# EAGLE design Croduino SAMD v1.0 (EAGLE 7.3.0)

## Sheet 1 of 3
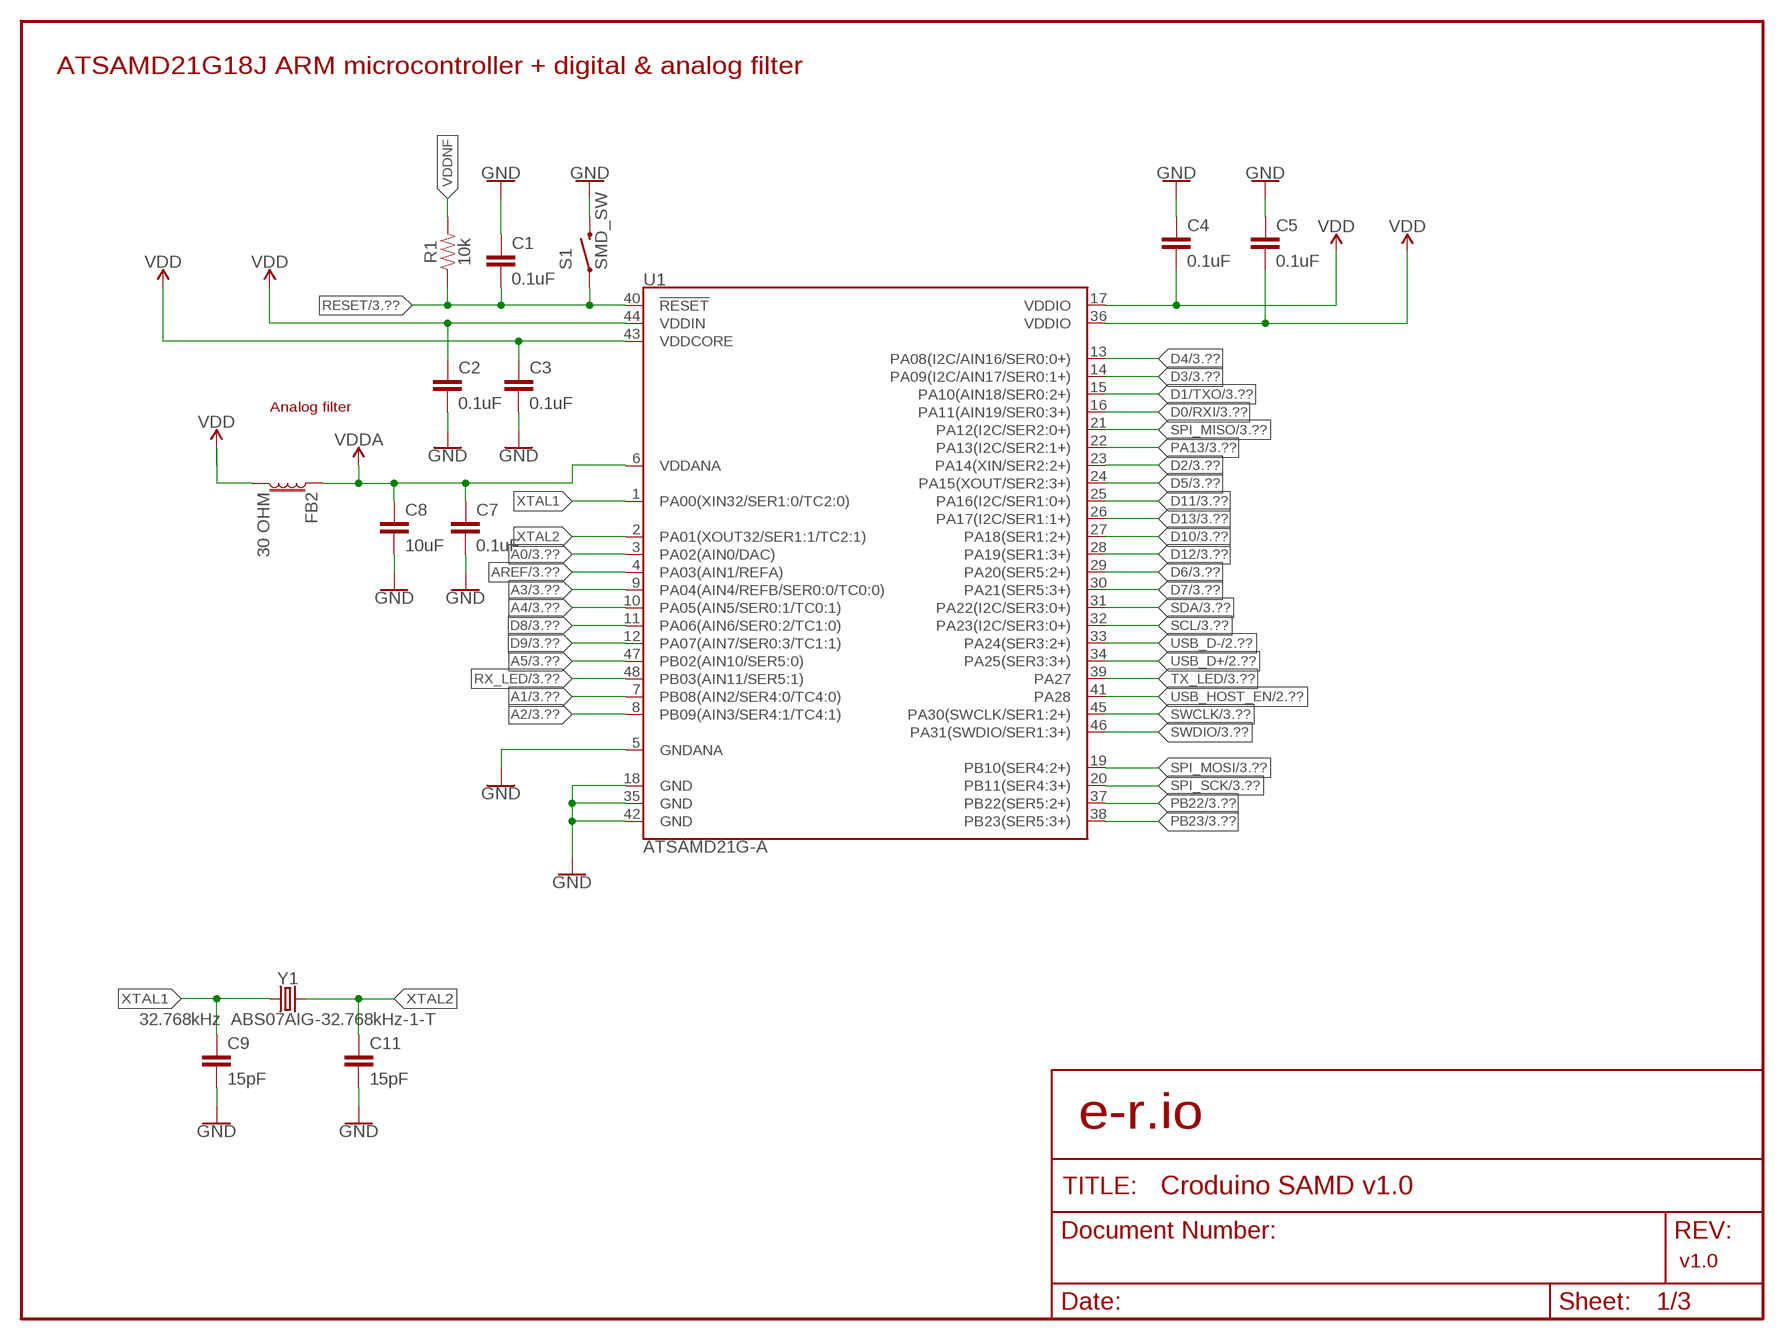
[diagram p0: schematic, sheet 1]

### Parts
C1  0.1uF  0.1UF-0603-25V-(+80/-20%)  [0603]
C2  0.1uF  0.1UF-0603-25V-(+80/-20%)  [0603]
C3  0.1uF  0.1UF-0603-25V-(+80/-20%)  [0603]
C4  0.1uF  0.1UF-0603-25V-(+80/-20%)  [0603]
C5  0.1uF  0.1UF-0603-25V-(+80/-20%)  [0603]
C7  0.1uF  0.1UF-0603-25V-(+80/-20%)  [0603]
C8  10uF  10UF-1206-6.3V-20%  [1206]
C9  15pF  15PF-0603-50V-5%  [0603]
C11  15pF  15PF-0603-50V-5%  [0603]
FB2  30 OHM  FERRITE_BEAD-0603  [0603]
R1  10k  10KOHM-0603-1/10W-1%  [0603]
S1  SMD_SW  SWITCH-MOMENTARY-2SMD  [TACTILE_SWITCH_SMD]
U1  ATSAMD21G-A  [TQFP-48]
Y1  32.768kHz ABS07AIG-32.768kHz-1-T  CRYSTAL-32.768KHZSMD-3.2X1.5  [CRYSTAL-SMD-3.2X1.5MM]

### Nets
A0: U1.3(PA02(AIN0/DAC)) ; also sheet 3
A1: U1.7(PB08(AIN2/SER4:0/TC4:0)) ; also sheet 3
A2: U1.8(PB09(AIN3/SER4:1/TC4:1)) ; also sheet 3
A3: U1.9(PA04(AIN4/REFB/SER0:0/TC0:0)) ; also sheet 3
A4: U1.10(PA05(AIN5/SER0:1/TC0:1)) ; also sheet 3
A5: U1.47(PB02(AIN10/SER5:0)) ; also sheet 3
AREF: U1.4(PA03(AIN1/REFA)) ; also sheet 3
D0/RXI: U1.16(PA11(AIN19/SER0:3+)) ; also sheet 3
D1/TXO: U1.15(PA10(AIN18/SER0:2+)) ; also sheet 3
D2: U1.23(PA14(XIN/SER2:2+)) ; also sheet 3
D3: U1.14(PA09(I2C/AIN17/SER0:1+)) ; also sheet 3
D4: U1.13(PA08(I2C/AIN16/SER0:0+)) ; also sheet 3
D5: U1.24(PA15(XOUT/SER2:3+)) ; also sheet 3
D6: U1.29(PA20(SER5:2+)) ; also sheet 3
D7: U1.30(PA21(SER5:3+)) ; also sheet 3
D8: U1.11(PA06(AIN6/SER0:2/TC1:0)) ; also sheet 3
D9: U1.12(PA07(AIN7/SER0:3/TC1:1)) ; also sheet 3
D10: U1.27(PA18(SER1:2+)) ; also sheet 3
D11: U1.25(PA16(I2C/SER1:0+)) ; also sheet 3
D12: U1.28(PA19(SER1:3+)) ; also sheet 3
D13: U1.26(PA17(I2C/SER1:1+)) ; also sheet 3
GND: C1.1 C2.2 C3.2 C4.1 C5.1 C7.2 C8.2 C9.2 C11.2 S1.3 U1.5(GNDANA) U1.18(GND) U1.35(GND) U1.42(GND) ; also sheet 2,3
PA13: U1.22(PA13(I2C/SER2:1+)) ; also sheet 3
PB22: U1.37(PB22(SER5:2+)) ; also sheet 3
PB23: U1.38(PB23(SER5:3+)) ; also sheet 3
RESET: C1.2 R1.1 S1.1 U1.40(!RESET!) ; also sheet 3
RX_LED: U1.48(PB03(AIN11/SER5:1)) ; also sheet 3
SCL: U1.32(PA23(I2C/SER3:0+)) ; also sheet 3
SDA: U1.31(PA22(I2C/SER3:0+)) ; also sheet 3
SPI_MISO: U1.21(PA12(I2C/SER2:0+)) ; also sheet 3
SPI_MOSI: U1.19(PB10(SER4:2+)) ; also sheet 3
SPI_SCK: U1.20(PB11(SER4:3+)) ; also sheet 3
SWCLK: U1.45(PA30(SWCLK/SER1:2+)) ; also sheet 3
SWDIO: U1.46(PA31(SWDIO/SER1:3+)) ; also sheet 3
TX_LED: U1.39(PA27) ; also sheet 3
USB_D+: U1.34(PA25(SER3:3+)) ; also sheet 2
USB_D-: U1.33(PA24(SER3:2+)) ; also sheet 2
USB_HOST_EN: U1.41(PA28) ; also sheet 2
VDD: C2.1 C3.1 C4.2 C5.2 FB2.2 U1.17(VDDIO) U1.36(VDDIO) U1.43(VDDCORE) U1.44(VDDIN) ; also sheet 2,3
VDDA: C7.1 C8.1 FB2.1 U1.6(VDDANA)
VDDNF: R1.2
XTAL1: C9.1 U1.1(PA00(XIN32/SER1:0/TC2:0)) Y1.P$1
XTAL2: C11.1 U1.2(PA01(XOUT32/SER1:1/TC2:1)) Y1.P$2

### Notes on the sheet
- ATSAMD21G18J ARM microcontroller + digital & analog filter
- Analog filter
- e-r.io
- v1.0

## Sheet 2 of 3
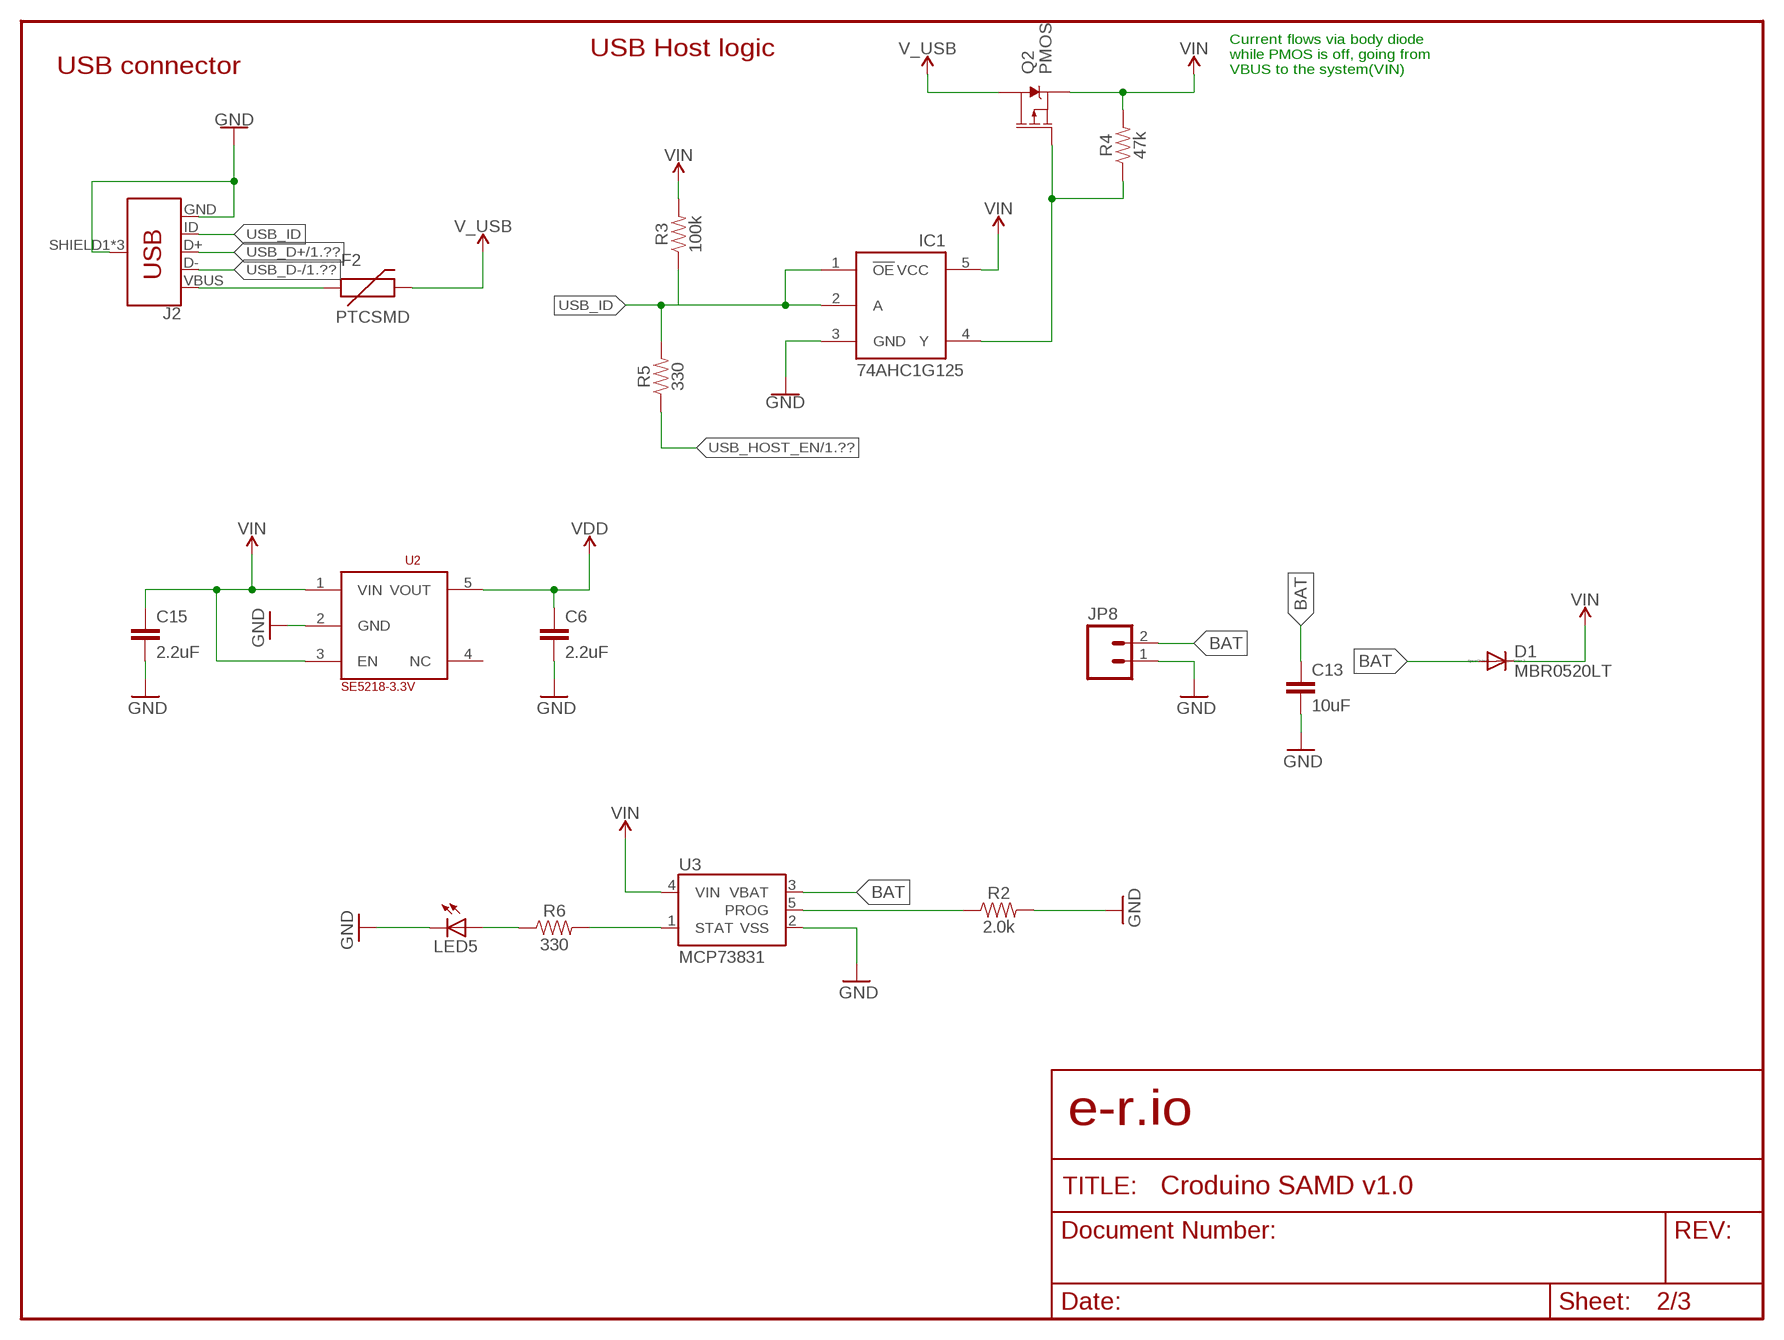
[diagram p1: schematic, sheet 2]

### Parts
C6  2.2uF  2.2UF-0603-10V-20%  [0603]
C13  10uF  10UF-1206-6.3V-20%  [1206]
C15  2.2uF  2.2UF-0603-10V-20%  [0603]
D1  MBR0520LT  [SOD123]
F2  PTCSMD  [PTC-1206]
IC1  74AHC1G125  [SOT23-5L]
J2  USB_MICRO-BREDUCED_PASTE  [USB-B-MICRO-SMD_RED_PASTE]
JP8  M02-JST-2MM-SMT  [JST-2-SMD]
LED5  LEDCHIPLED_0805  [CHIPLED_0805]
Q2  PMOS  MOSFET_PCH-DMG2307L  [SOT23-3]
R2  2.0k  2.0KOHM-0603-1/10W-5%  [0603]
R3  100k  100KOHM-0603-1/10W-1%  [0603]
R4  47k  47KOHM-0603-1/10W-1%  [0603]
R5  330  330OHM-0603-1/10W-1%  [0603]
R6  330  330OHM-0603-1/10W-1%  [0603]
U2  SE5218-3.3V  SE5218  [SOT23-5]
U3  MCP73831  [SOT23-5]

### Nets
BAT: C13.1 D1.A JP8.2 U3.3(VBAT)
GND: C6.2 C13.2 C15.2 IC1.3(GND) J2.GND J2.SHIELD1(SHIELD) J2.SHIELD2(SHIELD) J2.SHIELD3(SHIELD) JP8.1 LED5.C R2.2 U2.2(GND) U3.2(VSS) ; also sheet 1,3
N$2: R6.2 U3.1(STAT)
N$9: F2.1 J2.VBUS
N$10: IC1.4(Y) Q2.1(G) R4.1
N$11: LED5.A R6.1
N$12: R2.1 U3.5(PROG)
USB_D+: J2.D+ ; also sheet 1
USB_D-: J2.D- ; also sheet 1
USB_HOST_EN: R5.1 ; also sheet 1
USB_ID: IC1.1(!OE) IC1.2(A) J2.ID R3.1 R5.2
V_USB: F2.2 Q2.3(D) ; also sheet 3
VDD: C6.1 U2.5(VOUT) ; also sheet 1,3
VIN: C15.1 D1.C IC1.5(VCC) Q2.2(S) R3.2 R4.2 U2.1(VIN) U2.3(EN) U3.4(VIN) ; also sheet 3
Unconnected: U2.4(NC)

### Notes on the sheet
- USB Host logic
- USB connector
- Current flows via body diode
  while PMOS is off, going from
  VBUS to the system(VIN)
- e-r.io

## Sheet 3 of 3
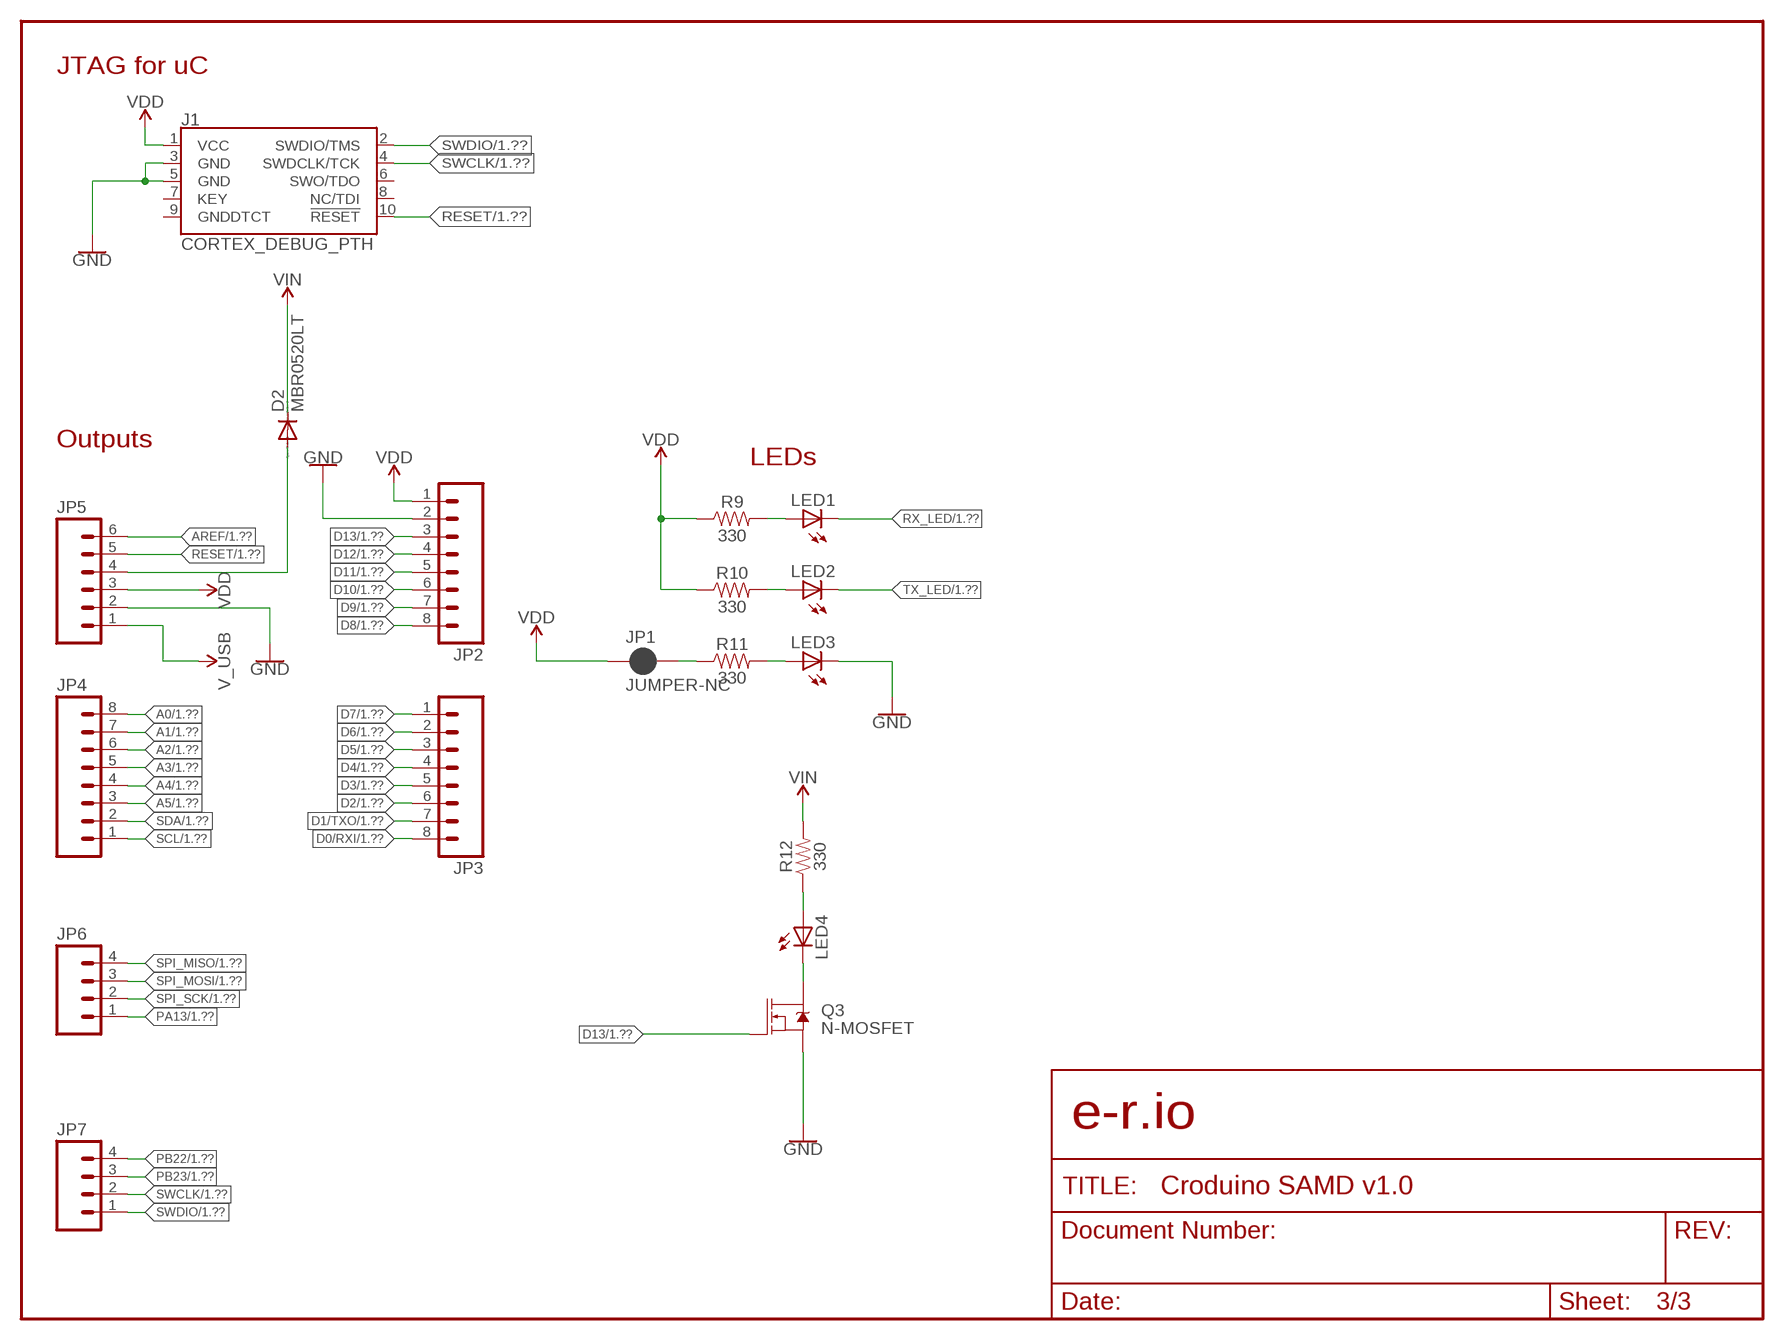
[diagram p2: schematic, sheet 3]

### Parts
D2  MBR0520LT  [SOD123]
J1  CORTEX_DEBUG_PTH  [2X5-PTH-1.27MM]
JP1  JUMPER-NC  JUMPER-SMT_2_NC_PASTE_NO-SILK  [SMT-JUMPER_2_NC_PASTE_NO-SILK]
JP2  M081X08  [1X08]
JP3  M081X08  [1X08]
JP4  M081X08  [1X08]
JP5  M06SIP  [1X06]
JP6  M04PTH  [1X04]
JP7  M04PTH  [1X04]
LED1  LEDCHIPLED_0805  [CHIPLED_0805]
LED2  LEDCHIPLED_0805  [CHIPLED_0805]
LED3  LEDCHIPLED_0805  [CHIPLED_0805]
LED4  LEDCHIPLED_0805  [CHIPLED_0805]
Q3  N-MOSFET  MOSFET-NCH-AO3404A  [SOT23-3]
R9  330  330OHM-0603-1/10W-1%  [0603]
R10  330  330OHM-0603-1/10W-1%  [0603]
R11  330  330OHM-0603-1/10W-1%  [0603]
R12  330  330OHM-0603-1/10W-1%  [0603]

### Nets
A0: JP4.8 ; also sheet 1
A1: JP4.7 ; also sheet 1
A2: JP4.6 ; also sheet 1
A3: JP4.5 ; also sheet 1
A4: JP4.4 ; also sheet 1
A5: JP4.3 ; also sheet 1
AREF: JP5.6 ; also sheet 1
D0/RXI: JP3.8 ; also sheet 1
D1/TXO: JP3.7 ; also sheet 1
D2: JP3.6 ; also sheet 1
D3: JP3.5 ; also sheet 1
D4: JP3.4 ; also sheet 1
D5: JP3.3 ; also sheet 1
D6: JP3.2 ; also sheet 1
D7: JP3.1 ; also sheet 1
D8: JP2.8 ; also sheet 1
D9: JP2.7 ; also sheet 1
D10: JP2.6 ; also sheet 1
D11: JP2.5 ; also sheet 1
D12: JP2.4 ; also sheet 1
D13: JP2.3 Q3.1(G) ; also sheet 1
GND: J1.3(GND) J1.5(GND) JP2.2 JP5.2 LED3.C Q3.2(S) ; also sheet 1,2
N$1: JP1.2 R11.1
N$3: LED4.A R12.1
N$4: D2.A JP5.4
N$5: LED3.A R11.2
N$6: LED2.A R10.2
N$7: LED1.A R9.2
N$8: LED4.C Q3.3(D)
PA13: JP6.1 ; also sheet 1
PB22: JP7.4 ; also sheet 1
PB23: JP7.3 ; also sheet 1
RESET: J1.10(!RESET) JP5.5 ; also sheet 1
RX_LED: LED1.C ; also sheet 1
SCL: JP4.1 ; also sheet 1
SDA: JP4.2 ; also sheet 1
SPI_MISO: JP6.4 ; also sheet 1
SPI_MOSI: JP6.3 ; also sheet 1
SPI_SCK: JP6.2 ; also sheet 1
SWCLK: J1.4(SWDCLK/TCK) JP7.2 ; also sheet 1
SWDIO: J1.2(SWDIO/TMS) JP7.1 ; also sheet 1
TX_LED: LED2.C ; also sheet 1
V_USB: JP5.1 ; also sheet 2
VDD: J1.1(VCC) JP1.1 JP2.1 JP5.3 R9.1 R10.1 ; also sheet 1,2
VIN: D2.C R12.2 ; also sheet 2
Unconnected: J1.6(SWO/TDO) J1.7(KEY) J1.8(NC/TDI) J1.9(GNDDTCT)

### Notes on the sheet
- JTAG for uC
- Outputs
- LEDs
- e-r.io

## Library data of the parts
C1-C5 C7 = SparkFun-Capacitors:0.1UF: 0.1µF ceramic capacitors A capacitor is a passive two-terminal electrical component used to store electrical energy temporarily in an electric field.; PROD_ID: CAP-00810
C6 C15 = SparkFun-Capacitors:2.2UF: 2.2µF ceramic capacitors A capacitor is a passive two-terminal electrical component used to store electrical energy temporarily in an electric field.; PROD_ID: CAP-07888
C8 C13 = SparkFun-Capacitors:10UF: 10.0µF ceramic capacitors A capacitor is a passive two-terminal electrical component used to store electrical energy temporarily in an electric field.; PROD_ID: CAP-10057
C9 C11 = SparkFun-Capacitors:15PF: 15pF ceramic capacitors A capacitor is a passive two-terminal electrical component used to store electrical energy temporarily in an electric field.; PROD_ID: CAP-07881
D1 D2 = diode:MBR0520LT: SCHOTTKY BARRIER RECTIFIER Source: http://onsemi.com .. MBR0520LT1-D.pdf
F2 = SparkFun:PTC: Resettable Fuse PTC Resettable Fuse. Spark Fun Electronics SKU : COM-08357
FB2 = SparkFun-Coils:FERRITE_BEAD: Ferrite Bead (blocks, cores, rings, chokes, etc.) Inductor with layers of ferrite used to suppress high frequencies. Often used to isolate high frequency noise. SparkFun Products: IOIO-OTG - V2.2 SparkFun SAMD21 Mini Breakout SparkFun 6 Degrees of Freedom Breakout - LSM6DS3 SparkFun SAMD21 Dev Breakout; PROD_ID: NDUC-07859; VALUE: 30Ω/1.8A
IC1 = adafruit:74AHC1G125
J1 = SparkFun-Connectors:CORTEX_DEBUG: Cortex Debug Connector - 10 pin Supports JTAG debug, Serial Wire debug, and Serial Wire Viewer. PTH and SMD connector options available. General Connector Information <http://infocenter.arm.com/help/topic/com.arm.doc.faqs/attached/13634/cortex_debug_connectors.pdf> Products: PTH Connector <http://www.digikey.com/product-detail/en/cnc-tech/3220-10-0100-00/1175-1627-ND/3883661> -via Digi-Key SparkFun PSoc <https://www.sparkfun.com/products/13229> SparkFun T <https://www.sparkfun.com/products/13810>
J2 = SparkFun-Connectors:USB_MICRO-B: USB Type Micro-B Connector Male/female and PTH/SMT variants SparkFun Products: SparkFun microB USB Breakout <https://www.sparkfun.com/products/12035> SparkFun USB microB Plug Breakout <https://www.sparkfun.com/products/10031> SparkFun ESP8266 Thing <https://www.sparkfun.com/products/13231>; PROD_ID: CONN-11752
JP1 = SparkFun-Jumpers:JUMPER-SMT_2_NC_PASTE: Normally closed solder jumper This jumper has an aperture in the stencil to allow solder paste to bridge the split in the wire so it's normally closed (NC). Wick off the solder to open the connection. Reapply solder to reclose the connection.
JP2-JP4 = SparkFun:M08: Header 8 Standard 8-pin 0.1" header. Use with straight break away headers (SKU : PRT-00116), right angle break away headers (PRT-00553), swiss pins (PRT-00743), machine pins (PRT-00117), and female headers (PRT-00115).
JP5 = SparkFun:M06: Header 6 Standard 6-pin 0.1" header. Use with straight break away headers (SKU : PRT-00116), right angle break away headers (PRT-00553), swiss pins (PRT-00743), machine pins (PRT-00117), and female headers (PRT-00115). Molex polarized connector foot print use with SKU : PRT-08094 with associated crimp pins and housings. NOTES ON THE VARIANTS LOCK and LOCK_LONGPADS... This footprint was designed to help hold the alignment of a through-hole component (i.e. 6-pin header) while soldering it into place. You may notice that each hole has been shifted either up or down by 0.005 of an inch from it's more standard position (which is a perfectly straight line). This slight alteration caused the pins (the squares in the middle) to touch the edges of the holes. Because they are alternating, it causes a "brace" to hold the component in place. 0.005 has proven to be the perfect amount of "off-center" position when using our standard breakaway headers. Although looks a little odd when you look at the bare footprint, once you have a header in there, the alteration is very hard to notice. Also, if you push a header all the way into place, it is covered up entirely on the bottom side. This idea of altering the position of holes to aid alignment will be further integrated into the Sparkfun Library for other footprints. It can help hold any component with 3 or more connection pins.
JP6 JP7 = SparkFun:M04: Header 4 Standard 4-pin 0.1" header. Use with straight break away headers (SKU : PRT-00116), right angle break away headers (PRT-00553), swiss pins (PRT-00743), machine pins (PRT-00117), and female headers (PRT-00115). Molex polarized connector foot print use with SKU : PRT-08231 with associated crimp pins and housings. 1MM SMD Version SKU: PRT-10208
JP8 = SparkFun:M02: Header 2 Standard 2-pin 0.1" header. Use with straight break away headers (SKU : PRT-00116), right angle break away headers (PRT-00553), swiss pins (PRT-00743), machine pins (PRT-00117), and female headers (PRT-00115). Molex polarized connector foot print use with SKU : PRT-08233 with associated crimp pins and housings.
LED1-LED5 = adafruit:LED: LED OSRAM: - CHIPLED LG R971, LG N971, LY N971, LG Q971, LY Q971, LO R971, LY R971 LH N974, LH R974 LS Q976, LO Q976, LY Q976 LO Q996 - Hyper CHIPLED LW Q18S LB Q993, LB Q99A, LB R99A - SideLED LS A670, LO A670, LY A670, LG A670, LP A670 LB A673, LV A673, LT A673, LW A673 LH A674 LY A675 LS A676, LA A676, LO A676, LY A676, LW A676 LS A679, LY A679, LG A679 - Hyper Micro SIDELED® LS Y876, LA Y876, LO Y876, LY Y876 LT Y87S - SmartLED LW L88C, LW L88S LB L89C, LB L89S, LG L890 LS L89K, LO L89K, LY L89K LS L896, LA L896, LO L896, LY L896 - TOPLED LS T670, LO T670, LY T670, LG T670, LP T670 LSG T670, LSP T670, LSY T670, LOP T670, LYG T670 LG T671, LOG T671, LSG T671 LB T673, LV T673, LT T673, LW T673 LH T674 LS T676, LA T676, LO T676, LY T676, LB T676, LH T676, LSB T676, LW T676 LB T67C, LV T67C, LT T67C, LS T67K, LO T67K, LY T67K, LW E67C LS E67B, LA E67B, LO E67B, LY E67B, LB E67C, LV E67C, LT E67C LW T67C LS T679, LY T679, LG T679 LS T770, LO T770, LY T770, LG T770, LP T770 LB T773, LV T773, LT T773, LW T773 LH T774 LS E675, LA E675, LY E675, LS T675 LS T776, LA T776, LO T776, LY T776, LB T776 LHGB T686 LT T68C, LB T68C - Hyper Mini TOPLED® LB M676 - Mini TOPLED Santana® LG M470 LS M47K, LO M47K, LY M47K Source: http://www.osram.convergy.de/
Q2 = SparkFun-DiscreteSemi:MOSFET_PCH: P-channel MOSFETs Voltage controlled devices that allow control of high current outputs. SparkFun Products: SparkFun ESP32 Thing <https://www.sparkfun.com/products/13907> SparkFun ESP8266 Thing <https://www.sparkfun.com/products/13231>; PROD_ID: TRANS-11308; VALUE: 2.5A/30V/105mΩ
Q3 = SparkFun-DiscreteSemi:MOSFET-NCH: N-channel MOSFETs Voltage controlled devices that allow control of high current outputs. SparkFun Products: SparkFun OpenScale <https://www.sparkfun.com/products/13261> SparkFun Digital Sandbox <https://www.sparkfun.com/products/12651> SparkFun Monster Moto Shield <https://www.sparkfun.com/products/10182> SparkFun MOSFET Power Controller <https://www.sparkfun.com/products/11214>; PROD_ID: TRANS-12988; VALUE: 5.8A/30V/35mΩ
R1 = SparkFun-Resistors:10KOHM: 10kΩ resistor A resistor is a passive two-terminal electrical component that implements electrical resistance as a circuit element. Resistors act to reduce current flow, and, at the same time, act to lower voltage levels within circuits. - Wikipedia; PROD_ID: RES-00824
R2 = SparkFun-Resistors:2.0KOHM: 2kΩ resistor A resistor is a passive two-terminal electrical component that implements electrical resistance as a circuit element. Resistors act to reduce current flow, and, at the same time, act to lower voltage levels within circuits. - Wikipedia; PROD_ID: RES-08296
R3 = SparkFun-Resistors:100KOHM: 100kΩ resistor A resistor is a passive two-terminal electrical component that implements electrical resistance as a circuit element. Resistors act to reduce current flow, and, at the same time, act to lower voltage levels within circuits. - Wikipedia; PROD_ID: RES-07828
R4 = SparkFun-Resistors:47KOHM: 47kΩ resistor A resistor is a passive two-terminal electrical component that implements electrical resistance as a circuit element. Resistors act to reduce current flow, and, at the same time, act to lower voltage levels within circuits. - Wikipedia; PROD_ID: RES-07871
R5 R6 R9-R12 = SparkFun-Resistors:330OHM: 330Ω resistor A resistor is a passive two-terminal electrical component that implements electrical resistance as a circuit element. Resistors act to reduce current flow, and, at the same time, act to lower voltage levels within circuits. - Wikipedia; PROD_ID: RES-00818
S1 = SparkFun:SWITCH-MOMENTARY-2
U1 = SparkFun-IC-Microcontroller:ATSAMD21G: Atmel SAMD21G SMART ARM-Based Microcontroller The Atmel ® | SMART ™ SAM D21 is a series of low-power microcontrollers using the 32-bit ARM ® Cortex ® -M0+ processor, and ranging from 32- to 64-pins with up to 256KB Flash and 32KB of SRAM. The SAM D21 devices operate at a maximum frequency of 48MHz and reach 2.46 CoreMark/MHz. They are designed for simple and intuitive migration with identical peripheral modules, hex compatible code, identical linear address map and pin compatible migration paths between all devices in the product series. All devices include intelligent and flexible peripherals, Atmel Event System for inter-peripheral signaling, and support for capacitive touch button, slider and wheel user interfaces. Datasheet SparkFun Products SparkFun SAMD21 Mini Breakout (DEV-13664) SparkFun SAMD21 Dev Breakout (DEV-13672); PROD_ID: IC-13064
U2 = ERADIONICA:SE5218
U3 = SparkFun-IC-Power:MCP73831: MCP73831T Li-Ion, Li-Pol Controller Miniature single cell, fully integrated Li-Ion, Li-polymer charge management controller Datasheet <http://ww1.microchip.com/downloads/en/DeviceDoc/20001984g.pdf> SparkFun Products: SparkFun ESP32 Thing <https://www.sparkfun.com/products/13907> SparkFun 9DoF Razor IMU M0 <https://www.sparkfun.com/products/14001>; PROD_ID: IC-09995
Y1 = SparkFun-Clocks:CRYSTAL-32.768KHZ: 32.768kHz Crystal Frequency: 32.768kHz Frequency Stability: ±20ppm Load Capacitance: 12.5pF (PTH-2X6 & SMD-3.2X1.5), 6pF (SMD-2X6) SparkFun Products: SparkFun BigTime Watch Kit <https://www.sparkfun.com/products/11734> SparkFun nRF52832 Breakout <https://www.sparkfun.com/products/13990> SparkFun Real Time Clock Module <https://www.sparkfun.com/products/12708>; PROD_ID: XTAL-13062; VALUE: 32.768kHz

## Board
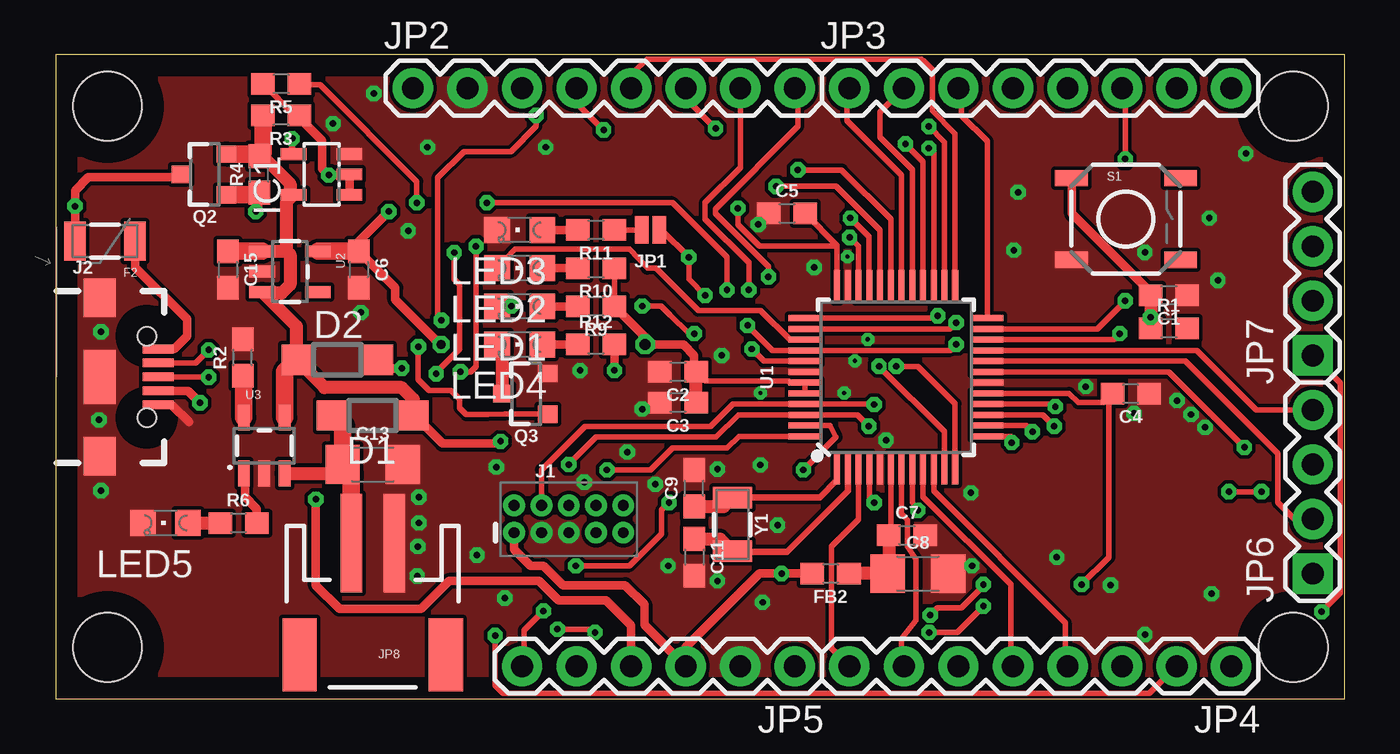
[diagram p3: board, top side]
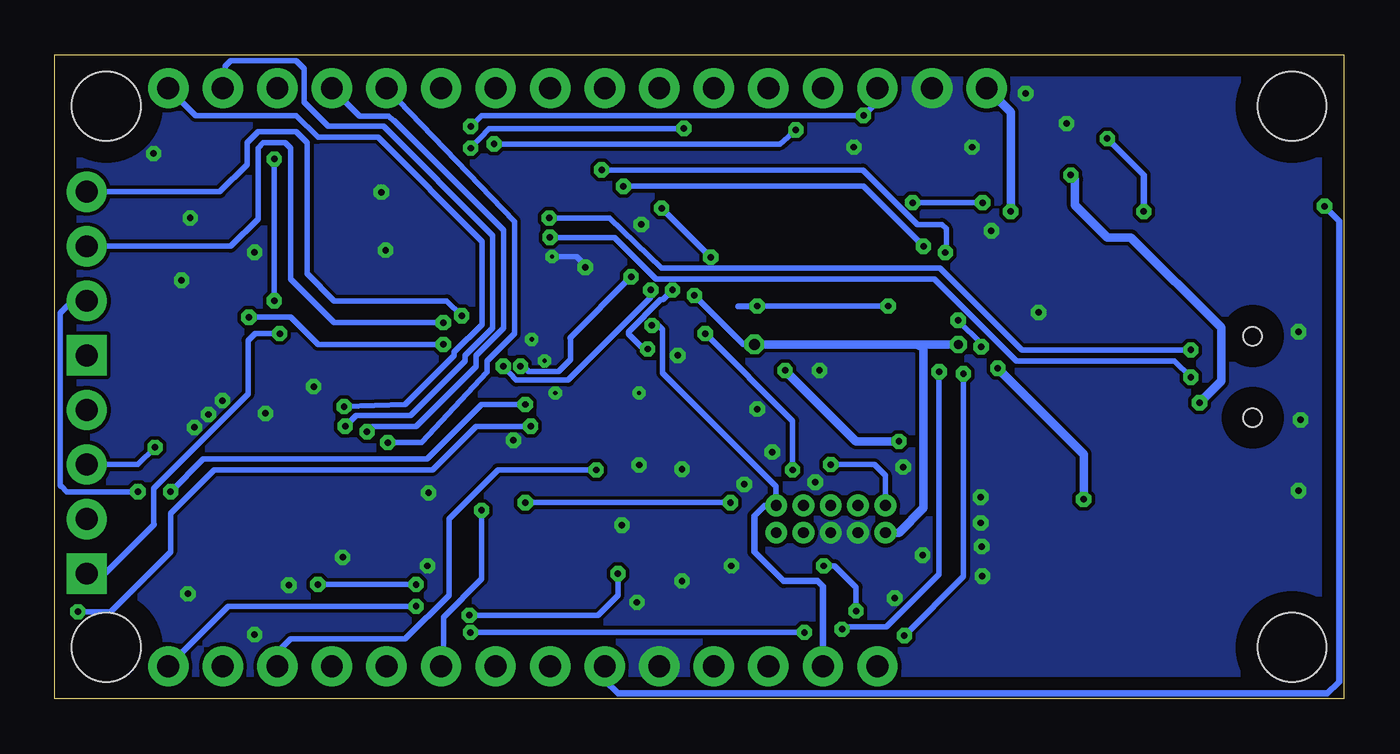
[diagram p4: board, bottom side, seen from below]

Size 60 x 30 mm. Coordinates in mm from the lower left corner, seen from the top.
Outline: 0,0 60,0 60,30 0,30 0,0
Copper layers (1*16): Top 0.035mm / dielectric 1.5mm / Bottom 0.035mm
Design rules "default *": minimum track width 10mil, minimum drill 24mil, track to track 0.17mm, track to pad 0.17mm, pad to pad 0.17mm, via to via 0.17mm, smd to smd 0.17mm, copper to edge 40mil, drill to drill 8mil, minimum pad ring 10mil, minimum via ring 8mil, stop-mask expansion 4mil, vias tented up to drill 0.6mm, thermal gap 10mil
Holes 3.2 mm at 2.4,2.4 2.4,27.6 57.6,2.4 57.6,27.6

### Footprints (pad centres in the part's own frame; a part is rotated, then mirrored left to right if it is on the bottom)
0603 = smd 1.1 x 1: 1 -0.85,0; 2 0.85,0
1206 = smd 1.6 x 1.8: 1 -1.4,0; 2 1.4,0
SOD123 = smd 1.4 x 1.4: A 1.9,0; C -1.9,0
PTC-1206 = smd 1 x 1.8: 1 -1.4,0; 2 1.4,0
SOT23-5L = smd 0.55 x 1.2: 1 -0.95,-1.3; 2 0,-1.3; 3 0.95,-1.3; 4 0.95,1.3; 5 -0.95,1.3
2X5-PTH-1.27MM = drill 0.508 pad 1: 1 -2.54,-0.635; 2 -2.54,0.635; 3 -1.27,-0.635; 4 -1.27,0.635; 5 0,-0.635; 6 0,0.635; 7 1.27,-0.635; 8 1.27,0.635; 9 2.54,-0.635; 10 2.54,0.635
USB-B-MICRO-SMD_RED_PASTE = smd 1.45 x 0.4: D+ 2.725,0; D- 2.725,0.65; GND 2.725,-1.3; ID 2.725,-0.65; VBUS 2.725,1.3 | smd 1.5 x 1.8: SHIELD1 0,3.685; SHIELD2 0,-3.685 | smd 1.5 x 2.5: SHIELD3 0,0 | hole 0.85: 2.2,1.9; 2.2,-1.9
SMT-JUMPER_2_NC_PASTE_NO-SILK = smd 0.635 x 1.27: 1 -0.406,0; 2 0.406,0
1X08 = drill 1.016 pad 1.88: 1 0,0; 2 2.54,0; 3 5.08,0; 4 7.62,0; 5 10.16,0; 6 12.7,0; 7 15.24,0; 8 17.78,0
1X06 = drill 1.016 pad 1.88: 1 0,0; 2 2.54,0; 3 5.08,0; 4 7.62,0; 5 10.16,0; 6 12.7,0
1X04 = drill 1.016 pad 1.88 square: 1 0,0 | drill 1.016 pad 1.88: 2 2.54,0; 3 5.08,0; 4 7.62,0
JST-2-SMD = smd 1 x 4.6: 1 -1,-3.7; 2 1,-3.7 | smd 1.6 x 3.4: NC1 -3.4,1.5; NC2 3.4,1.5
CHIPLED_0805 = smd 1.2 x 1.2: A 0,-1.05; C 0,1.05
SOT23-3 = smd 0.8 x 0.9: 1 -0.95,-1; 2 0.95,-1; 3 0,1.1
TACTILE_SWITCH_SMD = smd 1.524 x 0.762: 1 -2.54,1.905; 2 2.54,1.905; 3 -2.54,-1.905; 4 2.54,-1.905
TQFP-48 = smd 1.5 x 0.28: 1 -4.25,2.75; 2 -4.25,2.25; 3 -4.25,1.75; 4 -4.25,1.25; 5 -4.25,0.75; 6 -4.25,0.25; 7 -4.25,-0.25; 8 -4.25,-0.75; 9 -4.25,-1.25; 10 -4.25,-1.75; 11 -4.25,-2.25; 12 -4.25,-2.75; 25 4.25,-2.75; 26 4.25,-2.25; 27 4.25,-1.75; 28 4.25,-1.25; 29 4.25,-0.75; 30 4.25,-0.25; 31 4.25,0.25; 32 4.25,0.75; 33 4.25,1.25; 34 4.25,1.75; 35 4.25,2.25; 36 4.25,2.75 | smd 0.28 x 1.5: 13 -2.75,-4.25; 14 -2.25,-4.25; 15 -1.75,-4.25; 16 -1.25,-4.25; 17 -0.75,-4.25; 18 -0.25,-4.25; 19 0.25,-4.25; 20 0.75,-4.25; 21 1.25,-4.25; 22 1.75,-4.25; 23 2.25,-4.25; 24 2.75,-4.25; 37 2.75,4.25; 38 2.25,4.25; 39 1.75,4.25; 40 1.25,4.25; 41 0.75,4.25; 42 0.25,4.25; 43 -0.25,4.25; 44 -0.75,4.25; 45 -1.25,4.25; 46 -1.75,4.25; 47 -2.25,4.25; 48 -2.75,4.25
SOT23-5 = smd 0.55 x 1.2: 1 -0.95,-1.3; 2 0,-1.3; 3 0.95,-1.3; 4 0.95,1.3; 5 -0.95,1.3
CRYSTAL-SMD-3.2X1.5MM = smd 1 x 1.8: P$1 -1.25,0; P$2 1.25,0

### Placement (x,y rotation side)
C1  51.82,18.8 180 top
C2  28.96,15.24 180 top
C3  28.96,13.8 180 top
C4  50.04,14.22 180 top
C5  34.04,22.61 0 top
C6  14.1,20 270 top
C7  39.62,7.62 0 top
C8  40.13,5.84 0 top
C9  29.72,9.82 90 top
C11  29.72,6.6 270 top
C13  14.75,10.92 0 top
C15  8,20 270 top
D1  14.75,13.21 180 top
D2  13.1,15.8 0 top
F2  2.29,21.33 180 top
FB2  36.07,5.84 180 top
IC1  12.37,24.43 90 top
J1  23.88,8.38 0 top
J2  2.03,15 0 top
JP1  27.68,21.84 180 top
JP2  16.62,28.45 0 top
JP3  36.94,28.45 0 top
JP4  54.72,1.52 180 top
JP5  34.4,1.52 180 top
JP6  58.51,5.84 90 top
JP7  58.51,16 90 top
JP8  14.75,3.56 180 top
LED1  21.59,18.29 90 top
LED2  21.59,20.07 90 top
LED3  21.59,21.84 90 top
LED4  21.59,16.51 90 top
LED5  5.1,8.2 90 top
Q2  6.93,24.43 90 top
Q3  21.9,14.22 90 top
R1  51.82,17.27 0 top
R2  8.7,15.9 90 top
R3  10.49,27.17 180 top
R4  9.47,24.43 90 top
R5  10.49,28.65 180 top
R6  8.5,8.2 0 top
R9  25.15,18.29 180 top
R10  25.15,20.07 180 top
R11  25.15,21.84 180 top
R12  25.15,16.51 0 top
S1  49.82,22.35 0 top
U1  39.12,14.99 90 top
U2  10.9,19.9 270 top
U3  9.7,11.8 0 top
U$1  [SAMD-GRAFIKA]  44.2,5 0 top
U$2  [LOGO-4MM]  5.2,3 0 top
U$3  [OSH-3MM]  49.3,9.6 0 top
U$4  [E-R.IO-3MM]  3.9,13.6 90 top
U$8  [MADE-IN-CROATIA-5MM]  12.2,1.4 0 top
U$9  [LUDI-LOGO-24MM]  30.6,2.9 90 bottom
U$10  [SAMD-BACK]  13,0 0 top
U$11  [OSH-BACK-6MM]  7.2,21.5 270 top
U$12  [E-R.IO-6MM]  4.3,0.8 0 top
U$13  [LOGO-BACK-6MM]  7.2,14.1 270 top
U$14  [E-R.IO-BACK-12MM]  0,21.1 270 top
Y1  31.5,8.13 270 top

### Tracks (layer width: path | path; a pad name or v marks a point on that pad's centre or on a via)
A0
  Top 0.254: U1.3 37.37,8.37 36.1,7.1 36.1,2.36 JP4.8
A1
  Top 0.254: U1.7 39.37,8.63 39.65,8.35 39.65,7.1 40.05,6.5 40.05,3.67 39.37,2.79 39.37,1.63 JP4.7
A2  (via drill 0.3)
  Top 0.254: U1.8 39.87,9.16 v40.13,8.79
  Bottom 0.254: v40.13,8.79 40.13,5.59 41.91,3.81 41.91,1.63 JP4.6
A3
  Top 0.254: U1.9 40.37,9.42 44.45,5.33 44.45,1.63 JP4.5
A4
  Top 0.254: U1.10 40.87,9.68 46.99,3.56 46.99,1.63 JP4.4
A5  (via drill 0.3)
  Top 0.254: U1.47 36.03,12.74 36.32,12.19 v34.8,10.67
  Bottom 0.254: v34.8,10.67 39.37,10.67 41.66,8.38 41.66,4.83 43.69,2.79 49.02,2.79 49.53,2.29 49.53,1.27 49.78,1.02 49.78,1.38 JP4.3
AREF  (via drill 0.3)
  Top 0.254: U1.4 37.87,9.38 v38.1,9.14 | 22.66,4.06 21.8,3.2 21.8,1.62 JP5.6 | v24.2,6.2 26.7,6.2 28.2,7.7 28.2,8.8 v28.54,9.14
  Top 0.406: v22.7,4.1 22.66,4.06
  Bottom 0.254: v38.1,9.14 v28.54,9.14 28.5,9.1 | v22.7,4.1 22.7,5.2 23.7,6.2 v24.2,6.2
BAT
  Top 0.61: U3.3 13.45,10.5 13.75,10.2
  Top 0.813: JP8.2 13.75,10.2 13.75,10.52 C13.1 13.35,12.71 D1.A
D0/RXI  (via drill 0.3)
  Top 0.254: U1.16 46.46,13.74 v46.53,13.62
  Bottom 0.254: v46.53,13.62 43.69,13.72 41.4,16 41.4,16.15 40.1,17.45 40.1,21.3 44.96,26.16 47.75,26.16 48.77,27.18 53.45,27.18 JP3.8
D1/TXO  (via drill 0.3)
  Top 0.254: U1.15 45.95,13.24 v46.48,12.7
  Bottom 0.254: v46.48,12.7 45.97,13.21 43.43,13.21 40.89,15.75 40.89,16 39.62,17.27 39.62,21.59 44.7,26.67 47.27,26.67 48.4,27.8 48.4,29.35 48.77,29.72 51.82,29.72 52.07,29.46 52.07,28.56 JP3.7
D2  (via drill 0.3)
  Top 0.254: U1.23 48.48,17.24 v49.78,18.54 | v49.78,25.15 49.78,28.3 JP3.6
  Bottom 0.254: v49.78,18.54 v49.78,25.15
D3  (via drill 0.3)
  Top 0.254: U1.14 45.18,12.74 v45.47,12.45
  Bottom 0.254: v45.47,12.45 45.21,12.7 43.18,12.7 40.39,15.49 40.39,16 39.12,17.27 39.12,21.84 44.2,26.92 44.22,26.92 44.45,27.15 45.8,27.15 JP3.5
D4  (via drill 0.3)
  Top 0.254: U1.13 44.46,12.24 v44.5,11.95
  Bottom 0.254: v44.5,11.95 42.92,11.95 39.88,15.24 39.88,15.75 38.61,17.02 38.61,22.24 JP3.4
D5
  Top 0.254: U1.24 43.37,25.98 42.16,27.18 42.16,28.3 JP3.3
D6
  Top 0.254: U1.29 39.87,24.65 38.35,26.16 38.35,27.32 JP3.2
D7
  Top 0.254: U1.30 39.37,24.39 36.83,26.92 36.83,28.34 JP3.1
D8  (via drill 0.3)
  Top 0.254: U1.11 41.37,12.45 v38.32,15.49 | JP2.8 34.54,28.3 34.54,26.67 30.7,22.83 30.7,22.6 33.17,20.13 v33.17,19.66
  Bottom 0.254: v33.17,19.66 36.02,16.81 36,16.79 36,15.8 36.55,15.25 37.95,15.25 38.2,15.5 v38.32,15.5 v38.32,15.49
D9  (via drill 0.3)
  Top 0.254: JP2.7 31.86,24.75 30.23,23.11 30.23,22.35 32.26,20.32 v32.26,19.05 | v39.12,15.49 40.13,15.49 41.87,13.76 U1.12
  Bottom 0.254: v32.26,19.05 32.26,18.69 36.1,14.85 38.52,14.85 v39.12,15.49
D10  (via drill 0.3)
  Top 0.254: U1.27 40.87,25.43 v40.64,25.65 | JP2.6 29.21,28.34 29.21,28.07 v30.71,26.57
  Bottom 0.254: v40.64,25.65 39.77,26.57 v30.71,26.57
D11
  Top 0.254: U1.25 41.87,26.33 40.8,27.4 40.8,29.3 40.39,29.72 40.38,29.72 40.3,29.8 27.51,29.8 26.92,29.21 26.92,28.59 JP2.5
D12  (via drill 0.3)
  Top 0.254: U1.28 40.37,25.03 v39.55,25.85 | JP2.4 24.2,28.41 24.2,27.8 v25.5,26.5
  Bottom 0.254: v39.55,25.85 26.25,25.85 v25.5,26.5
D13  (via drill 0.3)
  Top 0.254: U1.26 41.37,25.94 v40.64,26.67 | Q3.1 20.91,13.27 20.09,13.25 19.1,13.25 18.8,13.55 18.8,13.97 18.39,14.38 17.37,14.38 16.87,14.88 v16.87,16.4 | v22.35,27.18 22.35,26.67 21.18,25.5 19,25.5 17.78,24.28 17.78,17.8 v17.95,17.63
  Bottom 0.254: v40.64,26.67 40.13,27.18 v22.35,27.18 21.84,27.69 21.84,28.3 JP2.3 | v16.87,16.4 16.87,16.56 v17.95,17.63
GND  (via drill 0.2, 0.3)
  Top 0.406: 6.2,12.9 5.4,13.7 J2.GND 4.7,13.7
  Bottom 0.254: 36.9,20.6 35.7,20.6 35.2,20.1
  other vias: 2.1,17.1 16.4,21.8 14.8,28.2 16.9,8.2 2,13 24.4,15.3 20.9,4.7 19.6,6.7 30.8,5.5 32.9,4.5 27.3,13.5 30.8,10.7 27.9,10 50.2,13.3 42.6,9.6 49.1,5.3 54.1,19.5 44.8,23.6 50.7,20.8 53.7,22.4 55.4,25.4 38.65,12.05 47.95,14.55 20.5,10.8 33.6,8.1 31,16 36.7,14.25 32.8,14.25 36.85,20.6 35.3,20.1 32.7,22.1 37.8,16.75 37.2,15.75 52.85,13.25 52.2,13.9 53.5,12.65 42.65,6.2 22.8,25.7 44.6,20.9 50.7,3 53.8,4.9 16.85,7.1 16.9,9.4 2.1,9.7 17.3,25.7 16.82,5.72 14.2,18 12.9,26.8 46.6,6.6 32.8,10.9 28.5,6.2 24.6,10.1 26.6,11.5
  pour Bottom (no thermals): 0,0 60,0 60,30 0,30
  pour Top (no thermals): 0,0 60,0 60,29 60,30 0,30
N$1
  Top 0.254: R11.1 JP1.2
N$2
  Top 0.406: R6.2 9.35,8.85 8.8,9.4 8.8,10.45 U3.1
N$3
  Top 0.406: LED4.A R12.1
N$4  (via drill 0.3)
  Top 0.406: JP5.4 26.78,3.42 25.6,4.6 23.4,4.6 22.5,5.5 18.3,5.5 17,4.2 13.2,4.2 12.1,5.3 v12.1,9.3 | v16.1,15.4 15.4,15.4 D2.A
  Bottom 0.406: v12.1,9.3 12.1,11.4 v16.1,15.4
N$5
  Top 0.406: LED3.A R11.2
N$6
  Top 0.406: LED2.A R10.2
N$7
  Top 0.406: LED1.A R9.2
N$8
  Top 0.61: Q3.3 20.8,16.15 LED4.C
N$9
  Top 0.406: J2.VBUS 5.5,16.3 6.1,16.9 6.1,17.7 3.7,20.1 3.7,20.81 F2.1
N$10  (via drill 0.3)
  Top 0.305: R4.1 9.47,22.87 v9.3,22.7 | v11,26.1 11,25.45 IC1.4
  Top 0.813: Q2.1 9.37,23.48 R4.1
  Bottom 0.305: v9.3,22.7 9.3,24.4 v11,26.1
N$11
  Top 0.61: LED5.A R6.1
N$12
  Top 0.813: U3.5 8.75,15 R2.1
PA13  (via drill 0.3)
  Top 0.254: U1.22 49.25,16.74 v49.53,17.02
  Bottom 0.254: v49.53,17.02 50.68,17.02 51,16.7 51,14.2 55.4,9.8 55.4,8.16 55.37,8.13 57.66,5.84 JP6.1
PB22  (via drill 0.3)
  Top 0.254: U1.37 40.94,17.74 v41.06,17.85
  Bottom 0.254: JP7.4 52.32,23.62 51.05,24.89 51.05,25.91 50.55,26.42 48.77,26.42 48.26,25.91 48.26,19.81 46.99,18.54 41.75,18.54 v41.06,17.85
PB23  (via drill 0.3)
  Top 0.254: U1.38 41.62,17.24 v41.91,17.53
  Bottom 0.254: v41.91,17.53 46.99,17.53 49.02,19.56 49.02,25.65 49.28,25.91 50.29,25.91 50.55,25.65 50.55,22.35 51.82,21.08 JP7.3
RESET  (via drill 0.3)
  Top 0.254: v41.91,16.51 41.64,16.24 U1.40 33.36,16.24 v32.2,17.4
  Top 0.406: C1.2 50.97,19.07 50.83,19.07 47.3,22.6 47.3,24.23 S1.1
  Top 0.61: C1.2 v50.97,17.78 R1.1
  Bottom 0.254: v41.91,16.51 47.75,16.51 49.02,17.78 v50.97,17.78 | v32.2,17.4 31.9,17.4 31.7,17.2 31.7,15.19 26.42,9.91 J1.10
  Bottom 0.305: JP5.5 24.24,5.24 24.5,5.5 26.07,5.5 27.43,6.86 27.43,8.52 26.95,9 26.43,9 J1.10
RX_LED  (via drill 0.3)
  Top 0.254: U1.48 31.79,12.24 31.24,11.68 28.7,11.68 27.69,10.67 v25.65,10.67 | v29.72,17.02 29.46,17.02 28.59,17.89 28.19,18.29 28.18,18.3 v27.3,18.3 | LED1.C 21.19,18.29 v21.2,18.3
  Bottom 0.254: v25.65,10.67 25.65,12.95 v29.72,17.02 | v21.2,18.3 v27.3,18.3 | v27.3,18.3 28.18,18.3 28.19,18.29 27.31,18.29 v27.3,18.3
SCL  (via drill 0.3)
  Top 0.254: U1.32 38.37,21.83 36.32,23.88 v33.53,23.88 | v19.56,21.08 19.56,15.49 19.3,15.24 v18.83,15.24 | v23.35,3.25 25.15,3.25 v25.1,3.1 | v40.65,3.1 41.96,3.1 v43.18,4.32
  Bottom 0.254: v33.53,23.88 22.35,23.88 v19.56,21.08 | v18.83,15.24 18.83,5.81 21.28,3.36 23.24,3.36 v23.35,3.25 | v25.1,3.1 v40.65,3.1 | v43.18,4.32 51.93,4.32 JP4.1
SDA  (via drill 0.3)
  Top 0.254: U1.31 38.87,22.35 36.58,24.64 v34.54,24.64 | v18.54,20.79 18.54,19.56 18.8,19.3 18.8,16.3 17.7,15.2 v17.7,15.15 | v20.45,2.95 20.45,0.63 20.83,0.25 50.91,0.25 JP4.2
  Bottom 0.254: v34.54,24.64 22.39,24.64 19.85,22.1 18.7,22.1 18.5,21.9 18.5,20.83 v18.54,20.79 | v17.7,15.15 17.7,5.7 v20.45,2.95
SPI_MISO
  Top 0.254: U1.21 53.11,16.24 55.88,13.46 JP6.4
SPI_MOSI  (via drill 0.3)
  Top 0.254: U1.19 51.82,15.24 v55.33,11.72
  Bottom 0.254: JP6.3 56.13,10.92 v55.33,11.72
SPI_SCK
  Top 0.254: U1.20 52.59,15.74 56.9,11.43 56.9,9.14 57.66,8.38 JP6.2
SWCLK  (via drill 0.3)
  Top 0.254: J1.4 22.61,10.67 24.64,12.7 30.48,12.7 31.52,13.74 U1.45 38.08,13.74 v38.1,13.72 | v54.61,9.65 v56.13,9.65
  Bottom 0.254: v38.1,13.72 40.13,13.72 42.67,11.18 53.09,11.18 v54.61,9.65 | v56.13,9.65 59.44,9.65 59.69,9.91 59.71,9.91 59.75,9.95 59.75,17.97 59.18,18.54 JP7.2
SWDIO  (via drill 0.3)
  Top 0.254: v23.88,10.92 25.15,12.19 30.73,12.19 31.78,13.24 U1.46 37.31,13.24 v37.85,12.7 | v58.93,4.06 58.93,4.08 59.8,4.95 59.8,14.72 JP7.1
  Bottom 0.254: v23.88,10.92 21.84,10.92 21.34,10.41 J1.2 | v37.85,12.7 40.39,12.7 42.42,10.67 52.58,10.67 54.61,8.64 54.61,6.86 57.4,4.06 v58.93,4.06
TX_LED
  Top 0.254: U1.39 34.16,16.74 32.8,18.1 29.91,18.1 27.94,20.07 27.53,20.07 26.7,20.95 21.37,20.95 LED2.C
USB_D+  (via drill 0.3)
  Top 0.254: U1.34 37.37,21.08 v36.95,21.5 | v7.11,14.99 4.77,14.99 J2.D+
  Bottom 0.254: v36.95,21.5 33.95,21.5 32,19.56 19.05,19.56 15.24,15.75 7.87,15.75 v7.11,14.99
USB_D-  (via drill 0.3)
  Top 0.254: J2.D- 6.51,15.65 v7.11,16.26 | U1.33 37.85,19.26 37.85,21.54 v36.98,22.4
  Bottom 0.254: v7.11,16.26 14.99,16.26 18.8,20.07 31.75,20.07 34.18,22.4 v36.98,22.4
USB_HOST_EN  (via drill 0.3)
  Top 0.254: U1.41 32.96,15.74 v32.4,16.3 | v31.24,19.05 31.24,20.57 28.7,23.11 v20.07,23.11 | v16.8,23.11 16.8,24.1 12.3,28.6 11.39,28.6 R5.1
  Top 0.813: R5.1 11.34,28.64 11.3,28.6
  Bottom 0.254: v20.07,23.11 v16.8,23.11 | v32.4,16.3 32.6,16.3 33.3,17 33.3,17.1 31.8,18.6 31.69,18.6 v31.24,19.05
USB_ID  (via drill 0.3)
  Top 0.254: R3.1 11.12,27.17 R5.2
  Top 0.406: IC1.1 IC1.2 13.64,24.4 v12.7,24.4 12.4,24.7 12.4,26 11.34,27.06 R3.1 | R5.2 9.86,28.65 | J2.ID 6.15,14.35 v6.7,13.8
  Bottom 0.406: v6.7,13.8 5.7,14.8 5.7,17.3 9.9,21.5 11,21.5 12.5,23 12.5,24.2 v12.7,24.4
V_USB  (via drill 0.3)
  Top 0.406: F2.2 v0.89,22.95 0.89,23.69 1.5,24.3 5.7,24.3 Q2.3
  Bottom 0.305: JP5.1 34.4,0.87 33.78,0.25 0.76,0.25 0.25,0.76 0.24,0.76 0.2,0.8 0.2,22.27 v0.89,22.95
VDD  (via drill 0.3, 0.4, 0.5)
  Top 0.254: C5.2 36.37,21.13 U1.36 36.37,21.04 36.32,21.08 32.77,21.08 31.75,22.1 v31.75,22.86 | U1.44 U1.43 34.16,14.74 34.1,14.8 30.25,14.8 C2.1 | v30.23,18.8 29.46,19.56 v29.46,20.57 28.19,21.84 JP1.1 | 49.01,14.24 49.02,14.22 49.02,14.1 | 49.02,14.1 49.02,6.6 v47.75,5.33 | v43.18,5.33 43.18,5.28 42.15,4.25 41.05,4.25 v40.7,3.9 | U1.17 47.16,14.24 47.6,13.8 48.76,13.8 C4.2 49.15,14.22 49.02,14.1 | R9.1 R10.1
  Top 0.406: C2.1 29.72,15.33 29.72,16 29.21,16.51 v27.43,16.51 27.43,16.85 R9.1 | FB2.2 v33.78,5.84 32.77,5.84 29.32,2.4 JP5.3 27.4,3.44 27.4,4.4 26.5,5.3 23.6,5.3 22.7,6.2 22.1,6.2 21.34,6.96 J1.1 | v15.5,22.7 14.1,21.3 C6.1 15.8,19.15 15.8,18.6 17.89,16.51 v17.93,16.51
  Top 0.61: C3.1 C2.1
  Top 0.813: U2.5 C6.1
  Bottom 0.254: v30.23,18.8 27.94,16.51 v27.43,16.51 | 19.56,16.26 20.07,16.51 | v31.75,22.86 v29.46,20.57 | v47.75,5.33 v43.18,5.33 | v40.7,3.9 34.71,3.9 33.78,4.83 v33.78,5.84
  Bottom 0.406: v17.93,16.51 20.07,16.51 v27.43,16.51 | J1.1 20.7,7.75 19.56,8.89 19.56,16.26 | v15.5,22.7 15.5,27.33 JP2.1
VDDA
  Top 0.254: U1.6 38.87,7.71 C7.1
  Top 0.61: C7.1 38.77,5.88 C8.1 FB2.1
VIN  (via drill 0.3)
  Top 0.406: 16.65,13.25 18,11.9 20.6,11.9 v20.7,12 | v26,15.3 R12.2
  Top 0.61: U2.1 10.75,20.85 | 10.75,20.85 10.9,20.7 10.9,19.3 10.5,18.9 9.65,18.9 U2.3 11.2,17.35 D2.C 12.5,14.5 16.1,14.5 16.65,13.95 16.65,13.25 D1.C | 10.75,20.85 10.75,23.16 IC1.5 10.9,23.65 10.9,24 9.62,25.28 R4.2
  Top 0.813: Q2.2 9.37,25.38 R4.2 9.64,25.45 R3.2 | C15.1 U2.1 | U3.4 10.65,15.25 D2.C
  Bottom 0.406: v20.7,12 22.7,12 v26,15.3
XTAL1
  Top 0.305: U1.1 36.37,10.2 35.56,9.4 31.52,9.4 Y1.P$1
  Top 0.61: C9.1 31.09,8.97 Y1.P$1
XTAL2
  Top 0.305: U1.2 36.87,9.69 34.04,6.86 31.52,6.86 Y1.P$2
  Top 0.61: C11.1 30.92,7.45 Y1.P$2

### Text on the board
200bmp: 3V3 | gnd | 13 | 12 | 11 | 10 | 9 | 8 | 7 | 6 | 5 | 4 | 3 | 2 | 1 | 0 | PB22 | PWR | rst | PB23 | TX | SWCLK | TX | 13 | SWDIO | v1.1 | MISO | * | MOSI | DONE | SCK | PA13 | ref | rst | VIN | 3V3 | gnd | 5V | A0 | ' | A1 | A2 | A3 | A4 | A5 | SDA | SCL